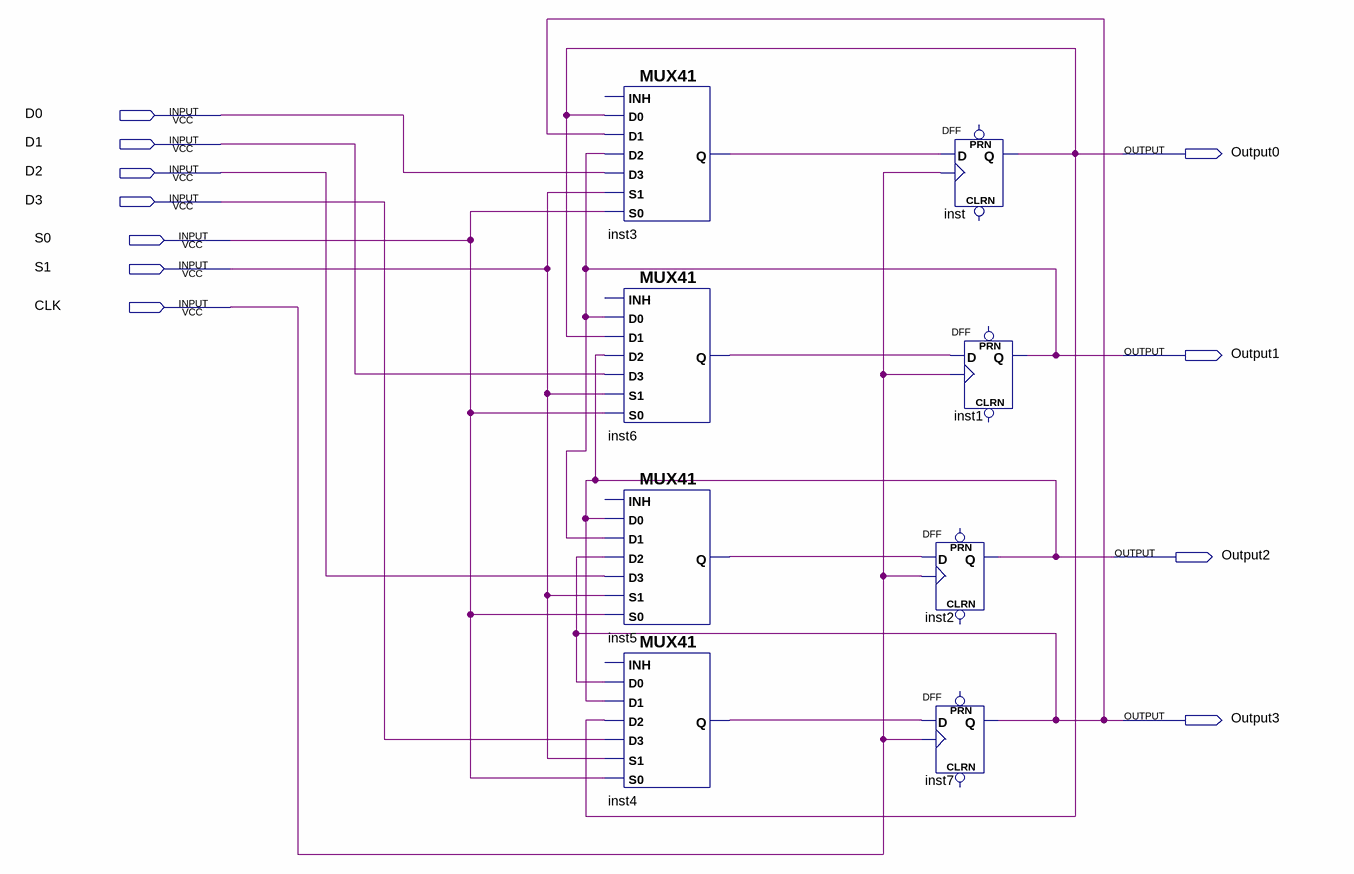
[diagram p0: schematic sheet]
// Quartus schematic B0829002_CO.bdf as structural Verilog: 8 symbols, 11 pins
module B0829002_CO (
  input  D0,
  input  D1,
  input  D2,
  input  D3,
  input  S0,
  input  S1,
  input  CLK,
  output Output0,
  output Output1,
  output Output2,
  output Output3
);

  wire inst3_q, inst4_q, inst5_q, inst6_q;

  MUX41 inst3 (.S0(S0), .D2(Output1), .S1(S1), .D3(D0), .D0(Output0), .D1(Output3), .Q(inst3_q));  // open: INH
  MUX41 inst6 (.S0(S0), .D2(Output2), .S1(S1), .D3(D1), .D0(Output1), .D1(Output0), .Q(inst6_q));  // open: INH
  MUX41 inst5 (.S0(S0), .D2(Output3), .S1(S1), .D3(D2), .D0(Output2), .D1(Output1), .Q(inst5_q));  // open: INH
  MUX41 inst4 (.S0(S0), .D2(Output0), .S1(S1), .D3(D3), .D0(Output3), .D1(Output2), .Q(inst4_q));  // open: INH
  DFF inst2 (.CLK(CLK), .D(inst5_q), .Q(Output2));  // open: CLRN, PRN
  DFF inst7 (.CLK(CLK), .D(inst4_q), .Q(Output3));  // open: CLRN, PRN
  DFF inst (.CLK(CLK), .D(inst3_q), .Q(Output0));  // open: CLRN, PRN
  DFF inst1 (.CLK(CLK), .D(inst6_q), .Q(Output1));  // open: CLRN, PRN
endmodule
